# EAGLE design Plug-In_Pet_Dip_Chip (EAGLE 9.6.2)
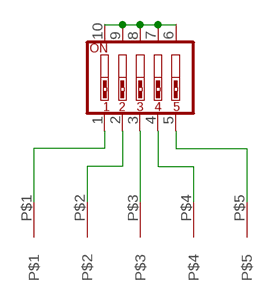
[diagram p0: schematic, sheet 1]

## Parts
SW2  SW_DIP-5  [EDG-05]
U$1  PLUGINPET  [PLUGINPET]

## Nets
N$1: SW2.6 SW2.7 SW2.8 SW2.9 SW2.10
N$2: SW2.1 U$1.P$1
N$3: SW2.2 U$1.P$2
N$4: SW2.3 U$1.P$3
N$5: SW2.4 U$1.P$4
N$6: SW2.5 U$1.P$5

## Library data of the parts
SW2 = special:SW_DIP-5: DIP SWITCH
U$1 = Plug-In Pet:PLUGINPET

## Board
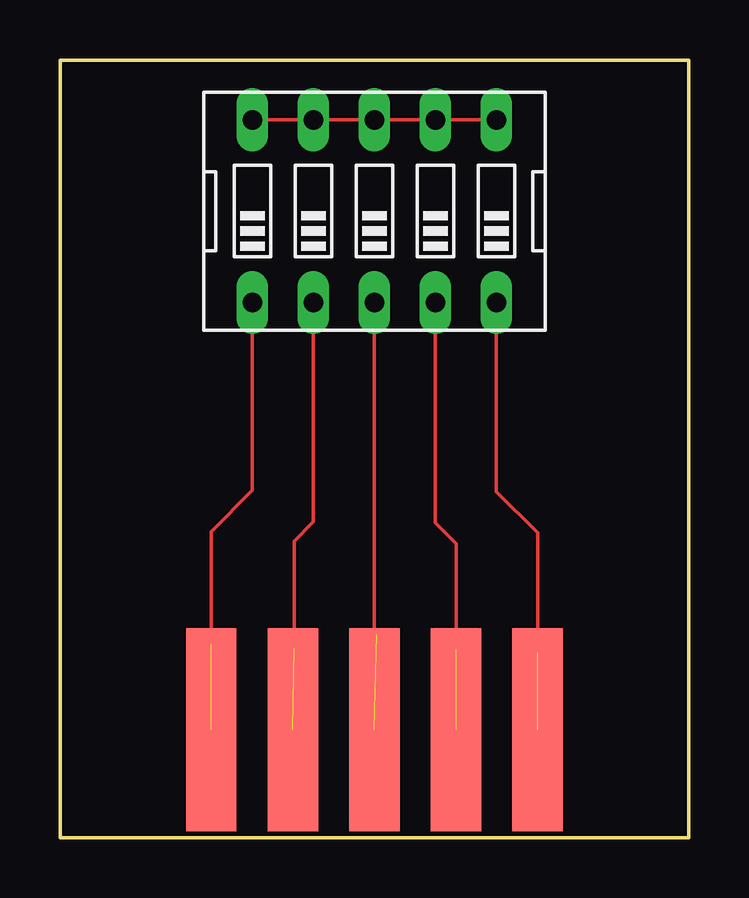
[diagram p1: board, top side]

Size 26.2 x 32.4 mm. Coordinates in mm from the lower left corner, seen from the top.
Outline: 26.2,0 0,0 0,32.4 26.2,32.4 26.2,0
Copper layers (1*16): Top 0.035mm / dielectric 1.5mm / Bottom 0.035mm
Design rules "default": minimum track width 6mil, minimum drill 0.35mm, track to track 6mil, track to pad 6mil, pad to pad 6mil, via to via 6mil, smd to smd 6mil, copper to edge 40mil, drill to drill 6mil, minimum pad ring 10mil, minimum via ring 8mil, stop-mask expansion 4mil, vias tented up to drill 0mil, thermal gap 10mil

### Footprints (pad centres in the part's own frame; a part is rotated, then mirrored left to right if it is on the bottom)
EDG-05 = drill 0.813 long: 1 -5.08,-3.81; 2 -2.54,-3.81; 3 0,-3.81; 4 2.54,-3.81; 5 5.08,-3.81; 6 5.08,3.81; 7 2.54,3.81; 8 0,3.81; 9 -2.54,3.81; 10 -5.08,3.81
PLUGINPET = smd 2.1 x 8.45: P$1 0,0; P$2 3.4,0; P$3 6.8,0; P$4 10.2,0; P$5 13.6,0

### Placement (x,y rotation side)
SW2  13.1,26.1 0 top
U$1  6.3,4.5 0 top

### Tracks (layer width: path | path; a pad name or v marks a point on that pad's centre or on a via)
N$1
  Top 0.152: SW2.10 SW2.9 SW2.8 SW2.7 SW2.6
N$2  (1 unrouted)
  Top 0.152: SW2.1 8.02,14.47 6.3,12.75 6.3,8.05
N$3  (1 unrouted)
  Top 0.152: SW2.2 10.56,13.16 9.75,12.35 9.75,7.9
N$4  (1 unrouted)
  Top 0.152: SW2.3 13.1,8.55 13.2,8.45
N$5  (1 unrouted)
  Top 0.152: SW2.4 15.64,13.11 16.5,12.25 16.5,7.85
N$6  (1 unrouted)
  Top 0.152: SW2.5 18.18,14.42 19.9,12.7 19.9,7.7